# EAGLE design 2004_converter_jl2tc (EAGLE 9.6.2)
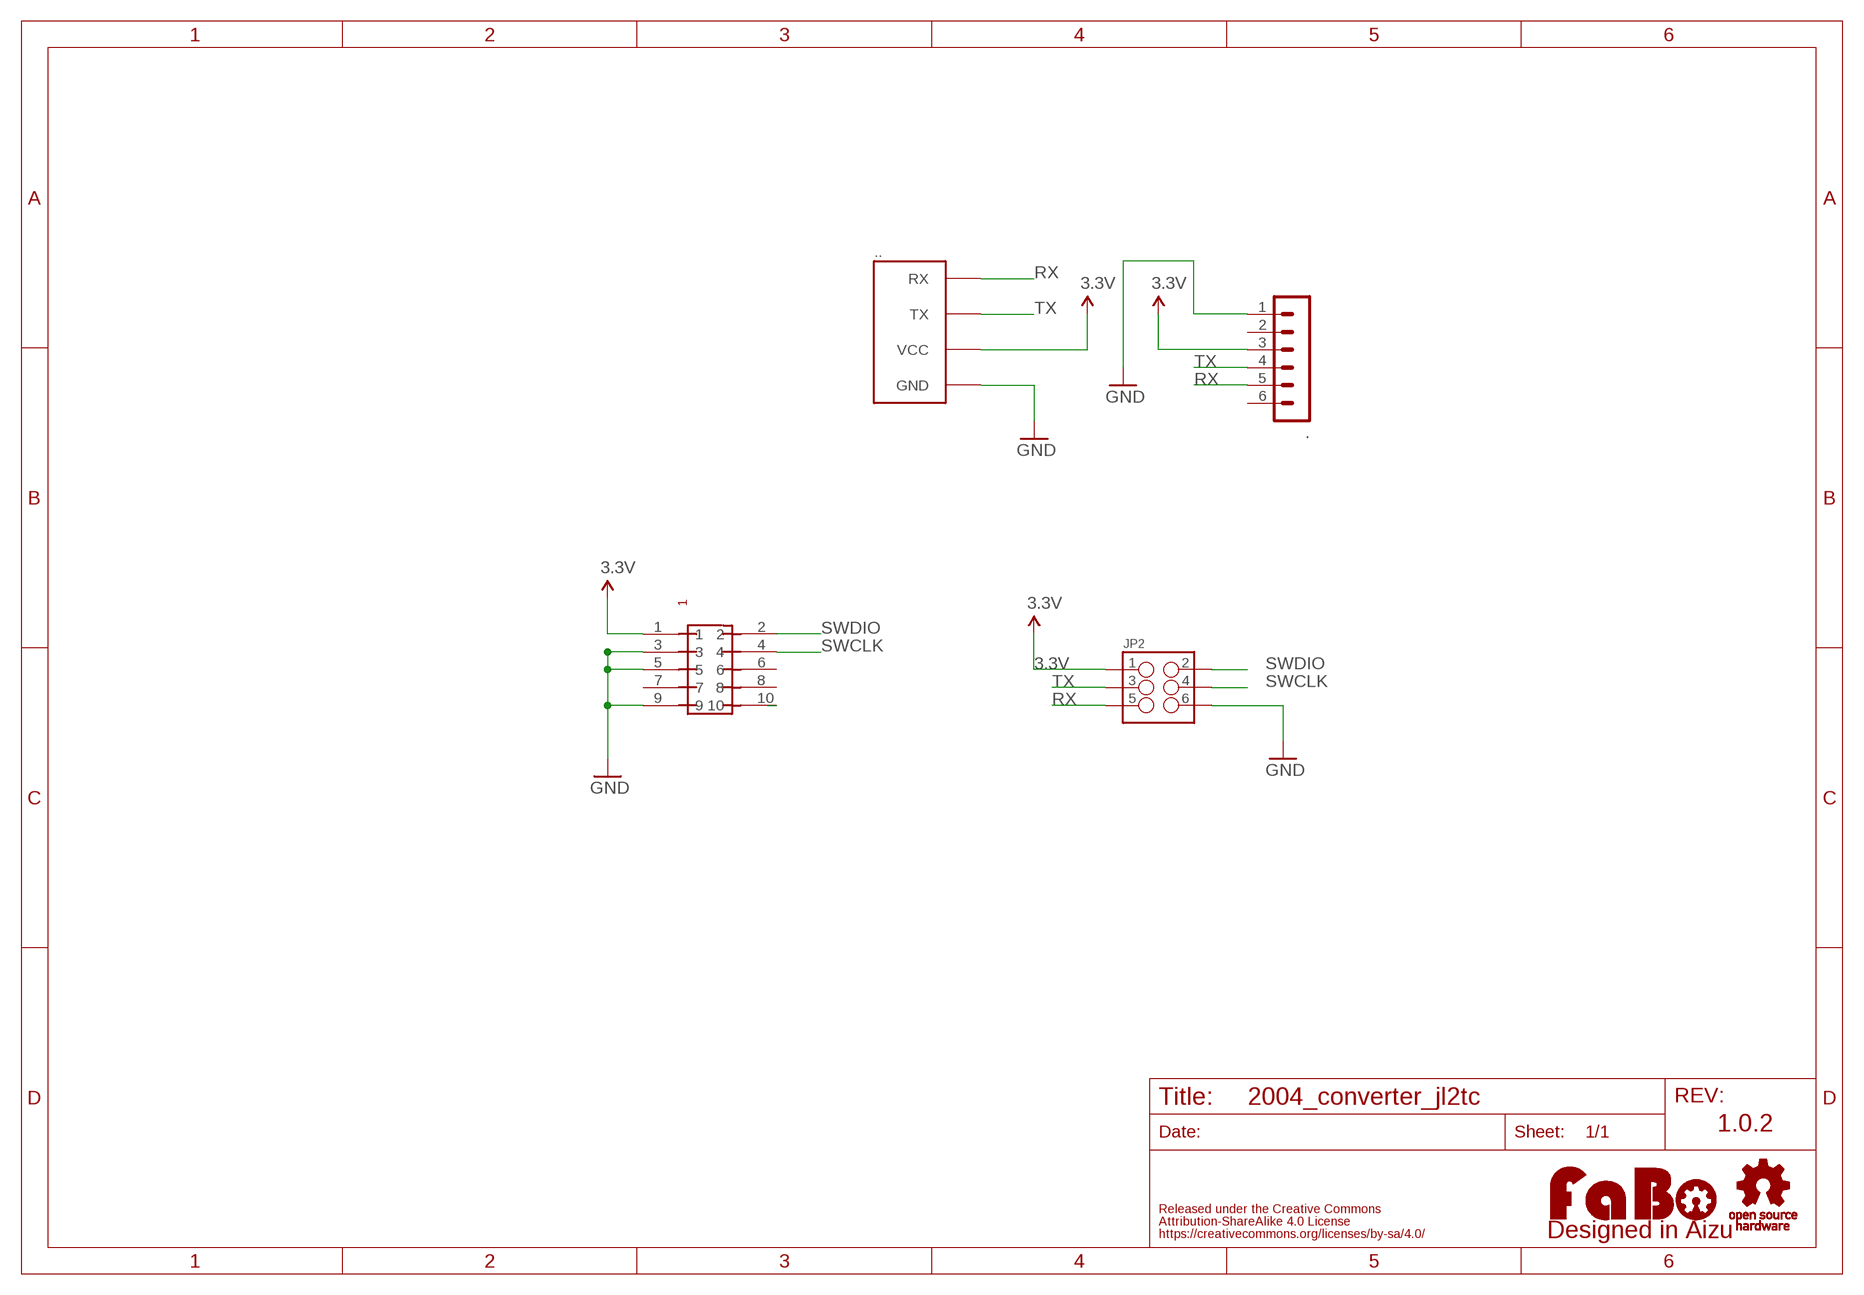
[diagram p0: schematic, sheet 1]

## Parts
.  MA06-1  [MA06-1]
..  FABO_BRICK_SERIAL-S04B-PASK-2  [FABO_BRICK_SERIAL_S04B-PASK-2]
JP2  M03X2  [2X3-SHROUDED]
U$1  LOGO_OSHW-M_BOTTOM  [LOGO_OSHW_M_BOTTOM]
U$4  LOGO_FABO-M  [LOGO_FABO_MS]
U$5  PIN-HEADER-SMT(1.27MM)2X5  [PIN-HEADER-SMT(1.27MM)2X5]

## Nets
3.3V: ..3 ...VCC JP2.1 U$5.1
GND: ..1 ...GND JP2.6 U$5.3 U$5.5 U$5.9
RESET: U$5.10
RX: ..5 ...RX JP2.5
SWCLK: JP2.4 U$5.4
SWDIO: JP2.2 U$5.2
TX: ..4 ...TX JP2.3
Unconnected: ..2 ..6 U$5.6 U$5.7 U$5.8

## Notes on the sheet
- 1.0.2

## Library data of the parts
. = con-lstb:MA06-1: PIN HEADER; OC_FARNELL: unknown; OC_NEWARK: unknown
.. = FaBo-Template:FABO_BRICK_SERIAL: FaBo Brick Serial
JP2 = SparkFun-Connectors:M03X2: 2x3 .1" header. Shrouded, with keying- CONN-10681 SMT- CONN-11415 Pogo pins- HW-11044; PROD_ID: CONN-10681
U$1 = FaBo-Logo:LOGO_OSHW
U$4 = FaBo-Logo:LOGO_FABO
U$5 = GClue:PIN-HEADER-SMT(1.27MM)2X5: PIN-HEADER-SMT (1.27MM) 2x5

## Board
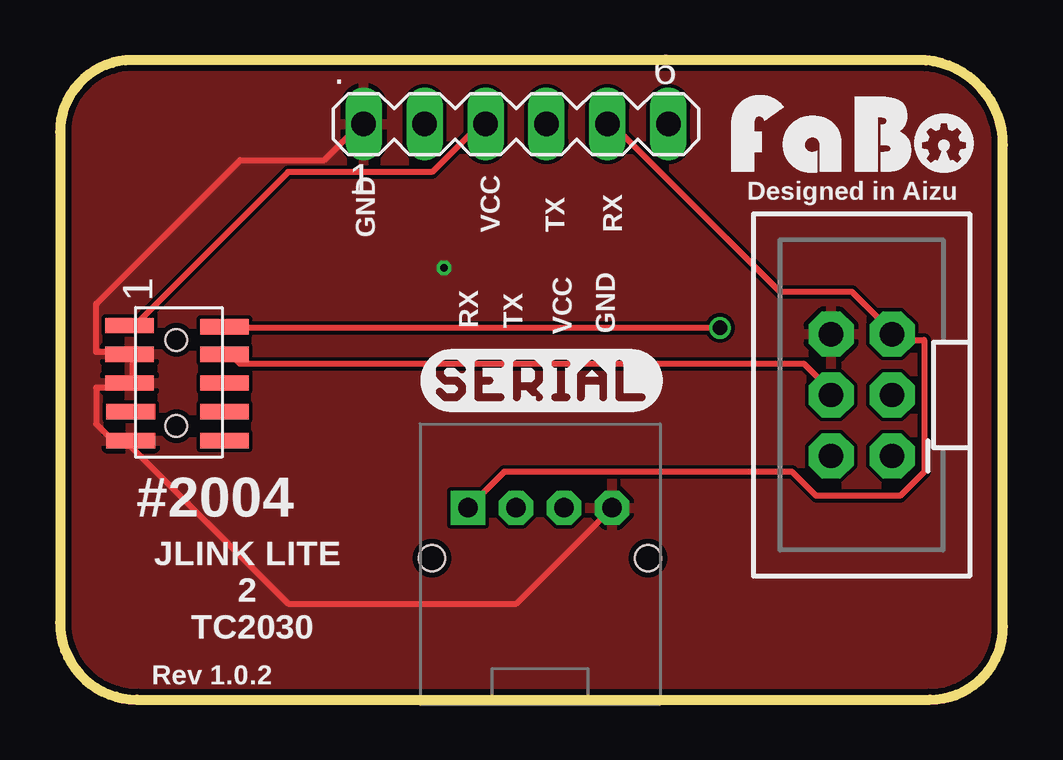
[diagram p1: board, top side]
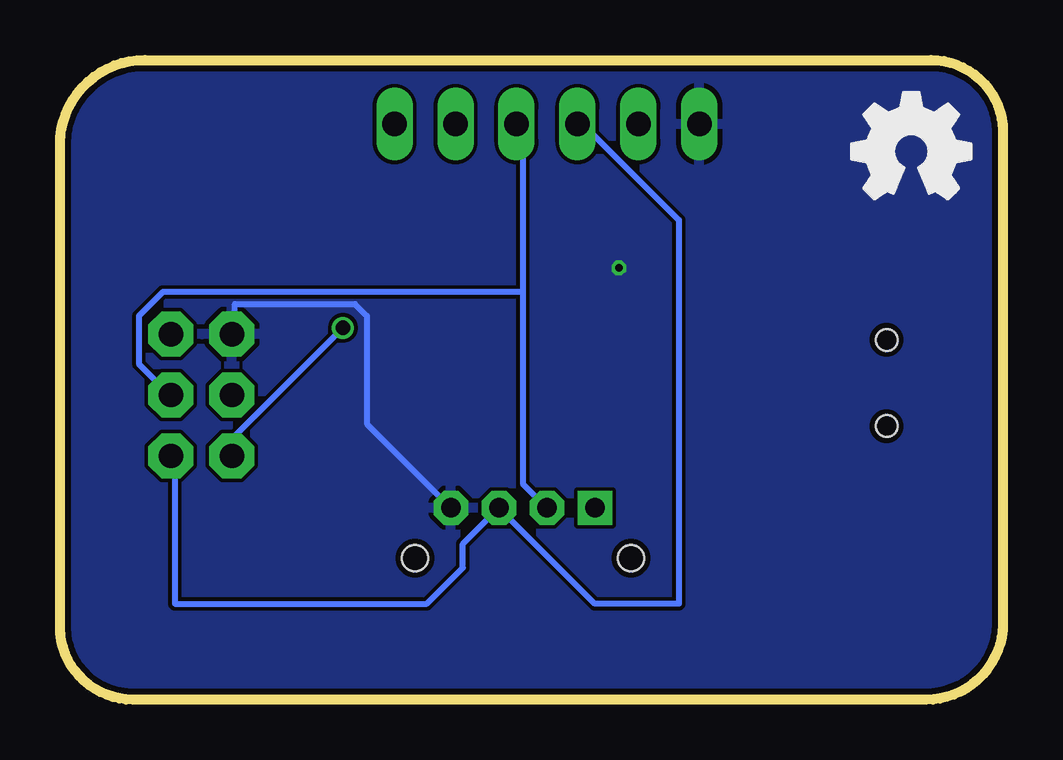
[diagram p2: board, bottom side, seen from below]

Size 39.29 x 26.67 mm. Coordinates in mm from the lower left corner, seen from the top.
Outline: 0,23.66 0,3.2 arc90 3.2,0 36.25,0 arc90 39.29,3.04 39.29,23.14 arc90 35.76,26.67 3.01,26.67 arc90 0,23.66
Copper layers (1*16): Top 0.035mm / dielectric 1.6mm / Bottom 0.035mm
Design rules "PCBway": minimum track width 6mil, minimum drill 12mil, track to track 6mil, track to pad 6mil, pad to pad 6mil, via to via 6mil, smd to smd 6mil, copper to edge 10mil, drill to drill 10mil, minimum pad ring 10mil, minimum via ring 6mil, stop-mask expansion 2mil, vias tented up to drill 100mil, thermal gap 8mil

### Footprints (pad centres in the part's own frame; a part is rotated, then mirrored left to right if it is on the bottom)
MA06-1 = drill 1.016 long: 1 -6.35,0; 2 -3.81,0; 3 -1.27,0; 4 1.27,0; 5 3.81,0; 6 6.35,0
FABO_BRICK_SERIAL_S04B-PASK-2 = drill 0.8 pad 1.422 octagon: GND -3,0; TX 1,0; VCC -1,0 | drill 0.8 pad 1.422 square: RX 3,0 | hole 1.1: 4.5,2.1; -4.5,2.1
2X3-SHROUDED = drill 1.016 pad 1.88 octagon: 1 -1.27,2.54; 2 1.27,2.54; 3 -1.27,0; 4 1.27,0; 5 -1.27,-2.54; 6 1.27,-2.54
PIN-HEADER-SMT(1.27MM)2X5 = smd 0.635 x 2.032: 1 -2.4,-1.95; 2 -2.35,2; 3 -1.2,-1.95; 4 -1.2,2; 5 0,-1.95; 6 0,2; 7 1.2,-1.9; 8 1.2,2; 9 2.4,-1.9; 10 2.4,2 | hole 0.9: 1.8,0; -1.8,0

### Placement (x,y rotation side)
.  19,24 0 top
..  20,8 180 top
JP2  33.4,12.7 180 top
U$1  3.81,22.86 0 top
U$2  [LOGO_SILK_SERIAL2]  15,12 0 top
U$4  33.02,21.59 0 top
U$5  4.85,13.2 270 top

### Tracks (layer width: path | path; a pad name or v marks a point on that pad's centre or on a via)
3.3V
  Top 0.254: U$5.1 3,15.5 9.5,22 15.5,22 17.5,24 ..3
  Bottom 0.254: JP2.1 34.5,10 34.5,4 24,4 22.5,5.5 22.5,6.5 ...VCC 17,4 13.5,4 13.5,20 17.5,24 ..3
GND  (via drill 0.3)
  Top 0.254: ..1 12.5,24 11,22.5 7.5,22.5 1.5,16.5 1.5,14.5 2.5,14.5 U$5.3 3,14.5 3,13.5 U$5.5 2.5,13 1.5,13 1.5,11.5 2,11 2.5,11 U$5.9 3,10.5 9.5,4 19,4 ...GND
  Bottom 0.254: ...GND 26.5,11.5 26.5,16 27,16.5 32,16.5 32,15.5 JP2.6
  other vias: 16,18
  pour Top: 0,0 40,0 40,27 0,27
  pour Bottom: 0,0 40,0 40,27 0,27
RX
  Top 0.254: ...RX 18.5,9.5 30.5,9.5 31.5,8.5 35,8.5 36,9.5 36,15 35,15 JP2.5 34.5,15.5 33,17 30,17 23,24 ..5
SWCLK
  Top 0.254: U$5.4 7,14.5 7.5,14 31,14 32,13 JP2.4
SWDIO  (via drill 0.61)
  Top 0.254: v27.5,15.5 7,15.5 U$5.2
  Bottom 0.254: v27.5,15.5 32,11 32,10.5 JP2.2
TX
  Bottom 0.254: ...TX 20,9 20,17 | 20,17 20,24 ..4 | 20,17 35,17 36,16 36,14 35,13 JP2.3

### Text on the board
tPlace: Designed in Aizu | GND | VCC | TX | RX | RX | TX | VCC | GND | #2004 | JLINK LITE / 2 / TC2030 | Rev 1.0.2